# Altium schematic sheet 1 040 1573.rev01_highside.SchDoc
size A4; SheetNumber: 2; SheetTotal: 5
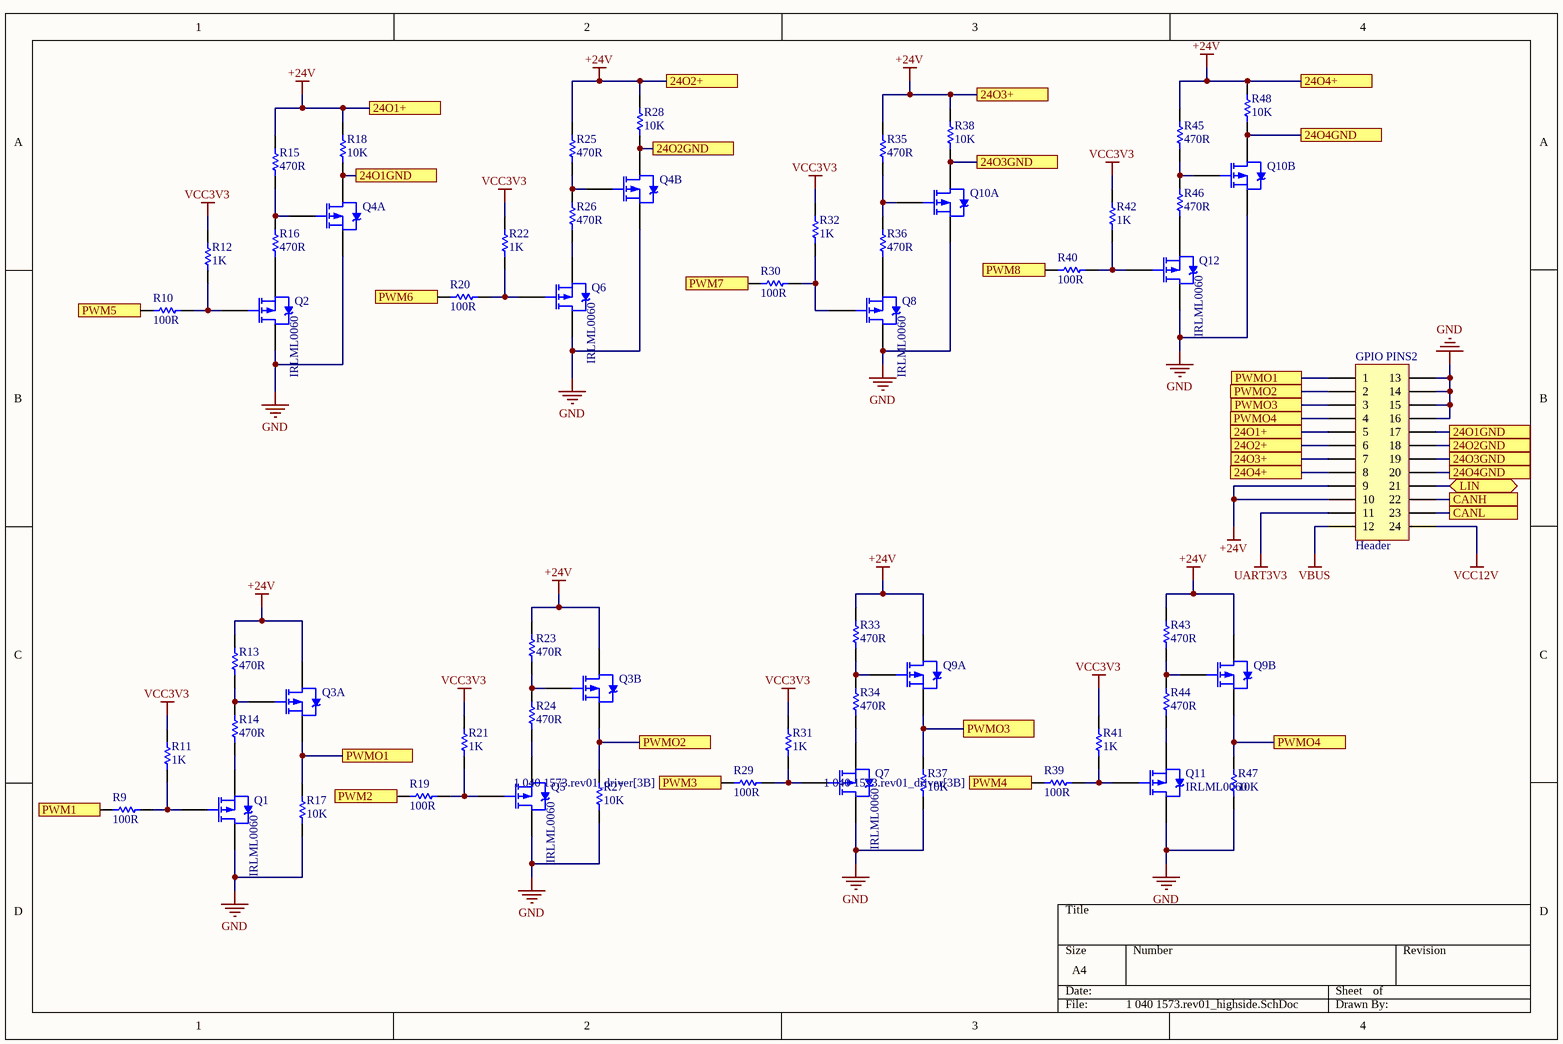
[diagram p0: 1 040 1573.rev01_highside.SchDoc]

## Parts
GPIO_PINS2  Header  [HDR2X12_CEN]
Q1  IRLML0060  [SOT_23]
Q2  IRLML0060  [SOT_23]
Q3  MOSFET_SMD_2PCH_55V_3.4A_SO8_INFINEON_IRF7342  [SO-8]  (value not drawn)  (parts A,B of 2)
Q4  MOSFET_SMD_2PCH_55V_3.4A_SO8_INFINEON_IRF7342  [SO-8]  (value not drawn)  (parts A,B of 2)
Q5  IRLML0060  [SOT_23]
Q6  IRLML0060  [SOT_23]
Q7  IRLML0060  [SOT_23]
Q8  IRLML0060  [SOT_23]
Q9  MOSFET_SMD_2PCH_55V_3.4A_SO8_INFINEON_IRF7342  [SO-8]  (value not drawn)  (parts A,B of 2)
Q10  MOSFET_SMD_2PCH_55V_3.4A_SO8_INFINEON_IRF7342  [SO-8]  (value not drawn)  (parts A,B of 2)
Q11  IRLML0060  [SOT_23]
Q12  IRLML0060  [SOT_23]
R9  100R  [Resistor(0603) -1]
R10  100R  [Resistor(0603) -1]
R11  1K  [Resistor(0603) -1]
R12  1K  [Resistor(0603) -1]
R13  470R  [Resistor(0805) -1]
R14  470R  [Resistor(0805) -1]
R15  470R  [Resistor(0805) -1]
R16  470R  [Resistor(0805) -1]
R17  10K  [Resistor(0805) -1]
R18  10K  [Resistor(0805) -1]
R19  100R  [Resistor(0603) -1]
R20  100R  [Resistor(0603) -1]
R21  1K  [Resistor(0603) -1]
R22  1K  [Resistor(0603) -1]
R23  470R  [Resistor(0805) -1]
R24  470R  [Resistor(0805) -1]
R25  470R  [Resistor(0805) -1]
R26  470R  [Resistor(0805) -1]
R27  10K  [Resistor(0805) -1]
R28  10K  [Resistor(0805) -1]
R29  100R  [Resistor(0603) -1]
R30  100R  [Resistor(0603) -1]
R31  1K  [Resistor(0603) -1]
R32  1K  [Resistor(0603) -1]
R33  470R  [Resistor(0805) -1]
R34  470R  [Resistor(0805) -1]
R35  470R  [Resistor(0805) -1]
R36  470R  [Resistor(0805) -1]
R37  10K  [Resistor(0805) -1]
R38  10K  [Resistor(0805) -1]
R39  100R  [Resistor(0603) -1]
R40  100R  [Resistor(0603) -1]
R41  1K  [Resistor(0603) -1]
R42  1K  [Resistor(0603) -1]
R43  470R  [Resistor(0805) -1]
R44  470R  [Resistor(0805) -1]
R45  470R  [Resistor(0805) -1]
R46  470R  [Resistor(0805) -1]
R47  10K  [Resistor(0805) -1]
R48  10K  [Resistor(0805) -1]

## Ports
24O1+ (see 1 040 1573.rev01_highside[1A]), 24O1+ (see 1 040 1573.rev01_highside[4B]), 24O1GND (see 1 040 1573.rev01_highside[1A]), 24O1GND (see 1 040 1573.rev01_highside[4B]), 24O2+ (see 1 040 1573.rev01_highside[2A]), 24O2+ (see 1 040 1573.rev01_highside[4B]), 24O2GND (see 1 040 1573.rev01_highside[2A]), 24O2GND (see 1 040 1573.rev01_highside[4B]), 24O3+ (see 1 040 1573.rev01_highside[3A]), 24O3+ (see 1 040 1573.rev01_highside[4B]), 24O3GND (see 1 040 1573.rev01_highside[3A]), 24O3GND (see 1 040 1573.rev01_highside[4B]), 24O4+ (see 1 040 1573.rev01_highside[4A]), 24O4+ (see 1 040 1573.rev01_highside[4B]), 24O4GND (see 1 040 1573.rev01_highside[4A]), 24O4GND (see 1 040 1573.rev01_highside[4B]), CANH (see 1 040 1573.rev01[2D]), CANL (see 1 040 1573.rev01[2D]), LIN (bidir, see 1 040 1573.rev01[1C]), PWM1 (in, see 1 040 1573.rev01_driver[3B]), PWM2 (in, see 1 040 1573.rev01_driver[3B]), PWM3 (in, see 1 040 1573.rev01_driver[3B]), PWM4 (in, see 1 040 1573.rev01_driver[3B]), PWM5 (in, see 1 040 1573.rev01_driver[3B]), PWM6 (in, see 1 040 1573.rev01_driver[3B]), PWM7 (in, see 1 040 1573.rev01_driver[3B]), PWM8 (in, see 1 040 1573.rev01_driver[3B]), PWMO1 (see 1 040 1573.rev01_highside[1C]), PWMO1 (see 1 040 1573.rev01_highside[4B]), PWMO2 (see 1 040 1573.rev01_highside[2C]), PWMO2 (see 1 040 1573.rev01_highside[4B]), PWMO3 (see 1 040 1573.rev01_highside[3C]), PWMO3 (see 1 040 1573.rev01_highside[4B]), PWMO4 (see 1 040 1573.rev01_highside[4B]), PWMO4 (see 1 040 1573.rev01_highside[4C])

## Nets
+24V: GPIO_PINS2.5 GPIO_PINS2.6 GPIO_PINS2.7 GPIO_PINS2.8 GPIO_PINS2.9 GPIO_PINS2.10 Q3.6(D2) Q3.7(D1) Q9.6(D2) Q9.7(D1) R13.2 R15.2 R18.2 R23.2 R25.2 R28.2 R33.2 R35.2 R38.2 R43.2 R45.2 R48.2 ; port 24O1+, port 24O2+, port 24O4+, port 24O3+
GND: GPIO_PINS2.13 GPIO_PINS2.14 GPIO_PINS2.15 GPIO_PINS2.16 Q1.1(D) Q2.1(D) Q4.1(S1) Q4.3(S2) Q5.1(D) Q6.1(D) Q7.1(D) Q8.1(D) Q10.1(S1) Q10.3(S2) Q11.1(D) Q12.1(D) R17.1 R27.1 R37.1 R47.1
UART3V3: GPIO_PINS2.11
VBUS: GPIO_PINS2.12
VCC3V3: R11.1 R12.1 R21.1 R22.1 R31.1 R32.1 R41.1 R42.1
VCC12V: GPIO_PINS2.24
24O1GND: GPIO_PINS2.17 Q4.7(D1) R18.1 ; port 24O1GND
24O2GND: GPIO_PINS2.18 Q4.6(D2) R28.1 ; port 24O2GND
24O3GND: GPIO_PINS2.19 Q10.7(D1) R38.1 ; port 24O3GND
24O4GND: GPIO_PINS2.20 Q10.6(D2) R48.1 ; port 24O4GND
CANH: GPIO_PINS2.22 ; port CANH
CANL: GPIO_PINS2.23 ; port CANL
LIN: GPIO_PINS2.21 ; port LIN
PWM1: R9.1 ; port PWM1
PWM2: R19.1 ; port PWM2
PWM3: R29.1 ; port PWM3
PWM4: R39.1 ; port PWM4
PWM5: R10.1 ; port PWM5
PWM6: R20.1 ; port PWM6
PWM7: R30.1 ; port PWM7
PWM8: R40.1 ; port PWM8
PWMO1: GPIO_PINS2.1 Q3.1(S1) R17.2 ; port PWMO1
PWMO2: GPIO_PINS2.2 Q3.3(S2) R27.2 ; port PWMO2
PWMO3: GPIO_PINS2.3 Q9.1(S1) R37.2 ; port PWMO3
PWMO4: GPIO_PINS2.4 Q9.3(S2) R47.2 ; port PWMO4
NetQ1_2: Q1.2(G) R9.2 R11.2
NetQ1_3: Q1.3(S) R14.1
NetQ2_2: Q2.2(G) R10.2 R12.2
NetQ2_3: Q2.3(S) R16.1
NetQ3_2: Q3.2(G1) R13.1 R14.2
NetQ3_4: Q3.4(G2) R23.1 R24.2
NetQ4_2: Q4.2(G1) R15.1 R16.2
NetQ4_4: Q4.4(G2) R25.1 R26.2
NetQ5_2: Q5.2(G) R19.2 R21.2
NetQ5_3: Q5.3(S) R24.1
NetQ6_2: Q6.2(G) R20.2 R22.2
NetQ6_3: Q6.3(S) R26.1
NetQ7_2: Q7.2(G) R29.2 R31.2
NetQ7_3: Q7.3(S) R34.1
NetQ8_2: Q8.2(G) R30.2 R32.2
NetQ8_3: Q8.3(S) R36.1
NetQ9_2: Q9.2(G1) R33.1 R34.2
NetQ9_4: Q9.4(G2) R43.1 R44.2
NetQ10_2: Q10.2(G1) R35.1 R36.2
NetQ10_4: Q10.4(G2) R45.1 R46.2
NetQ11_2: Q11.2(G) R39.2 R41.2
NetQ11_3: Q11.3(S) R44.1
NetQ12_2: Q12.2(G) R40.2 R42.2
NetQ12_3: Q12.3(S) R46.1

## Library data of the parts
GPIO_PINS2 = Header 12X2A: Header, 12-Pin, Dual row; LatestRevisionDate: 17-Jul-2002; LatestRevisionNote: Re-released for DXP Platform.; Publisher: Altium Limited
Q1 Q2 Q5-Q8 Q11 Q12 = MOSFET_SMD_NCH_60V_2.7A_SOT23_INFINEON_IRLML0060: 1 045 0018; Manufacturer: Infineon Technologies; Note: Pin 2 is electrically connected to pin 4.; Published: 8-Jun-2000; LatestRevisionDate: 17-Jul-2002; LatestRevisionNote: Re-released for DXP Platform.; DatasheetVersion: PD-9.814; PackageVersion: Feb-1997; PackageReference: TO-220AB; Publisher: Altium Limited; PackageDescription: TO, Thru-Hole, Vertical, Heatsink Mounted; 3 In-Line Leads; Pitch 2.54 mm; ComponentLink1Description: Manufacturer Link; ComponentLink1URL: http://www.irf.com/; Stok Kodu: 1 045 0018; Manufacturer Product Number: IRLML0060
Q3 Q4 Q9 Q10 = MOSFET_SMD_2PCH_55V_3.4A_SO8_INFINEON_IRF7342: 1 045 0014; Manufacturer: Infineon Technologies; Published: 8-Jun-2000; LatestRevisionDate: 17-Jul-2002; LatestRevisionNote: Re-released for DXP Platform.; PackageReference: SOT-23B; Publisher: Altium Limited; Code_JEDEC: SOT-23; Stok Kodu: 1 045 0014; Manufacturer Product Number: IRF7342
R9 R10 R19 R20 R29 R30 R39 R40 = RES_SMD_100R_%1_0603_AEC: 1 042 0269; Published: 8-Jun-2000; LatestRevisionDate: 17-Jul-2002; LatestRevisionNote: Re-released for DXP Platform.; PackageReference: AXIAL-0.3; Publisher: Altium Limited; Stok Kodu: 1 042 0269
R11 R12 R21 R22 R31 R32 R41 R42 = RES_SMD_1K_%1_0603_AEC: 1 042 0331; Published: 8-Jun-2000; LatestRevisionDate: 17-Jul-2002; LatestRevisionNote: Re-released for DXP Platform.; PackageReference: AXIAL-0.3; Publisher: Altium Limited; Stok Kodu: 1 042 0331
R13-R16 R23-R26 R33-R36 R43-R46 = RES_SMD_470R_%1_0805: 1 042 0476; Published: 8-Jun-2000; LatestRevisionDate: 17-Jul-2002; LatestRevisionNote: Re-released for DXP Platform.; PackageReference: AXIAL-0.3; Publisher: Altium Limited; Stok Kodu: 1 042 0476
R17 R18 R27 R28 R37 R38 R47 R48 = RES_SMD_10K_%1_0805: 1 042 0278; Published: 8-Jun-2000; LatestRevisionDate: 17-Jul-2002; LatestRevisionNote: Re-released for DXP Platform.; PackageReference: AXIAL-0.3; Publisher: Altium Limited; Stok Kodu: 1 042 0278